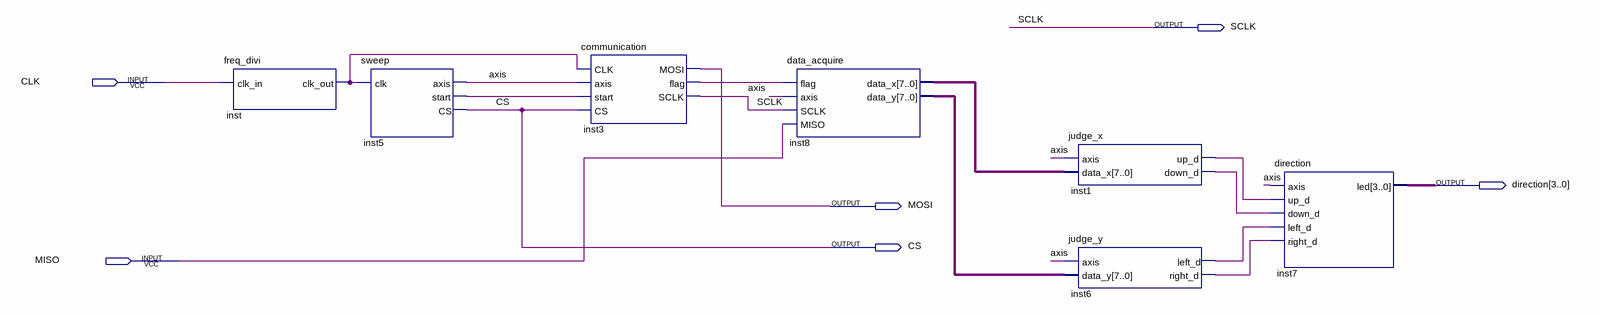
[diagram p0: schematic sheet]
// Quartus schematic direction_output.bdf as structural Verilog: 7 symbols, 6 pins
module direction_output (
  input  CLK,
  input  MISO,
  output SCLK,
  output [3:0] direction,
  output MOSI,
  output CS
);

  wire axis, inst1_down_d, inst1_up_d, inst3_flag, inst5_start, inst6_left_d, inst6_right_d, inst_clk_out;
  wire [7:0] inst8_data_x, inst8_data_y;

  freq_divi inst (.clk_in(CLK), .clk_out(inst_clk_out));
  sweep inst5 (.clk(inst_clk_out), .axis(axis), .start(inst5_start), .CS(CS));
  communication inst3 (
    .CLK(inst_clk_out), .axis(axis), .start(inst5_start), .CS(CS), .MOSI(MOSI), .flag(inst3_flag), .SCLK(SCLK));
  data_acquire inst8 (
    .flag(inst3_flag), .axis(axis), .SCLK(SCLK), .MISO(MISO), .data_x(inst8_data_x), .data_y(inst8_data_y));
  judge_x inst1 (.axis(axis), .data_x(inst8_data_x), .up_d(inst1_up_d), .down_d(inst1_down_d));
  judge_y inst6 (.axis(axis), .data_y(inst8_data_y), .left_d(inst6_left_d), .right_d(inst6_right_d));
  direction inst7 (
    .axis(axis), .up_d(inst1_up_d), .down_d(inst1_down_d), .left_d(inst6_left_d), .right_d(inst6_right_d),
    .led(direction));
endmodule
